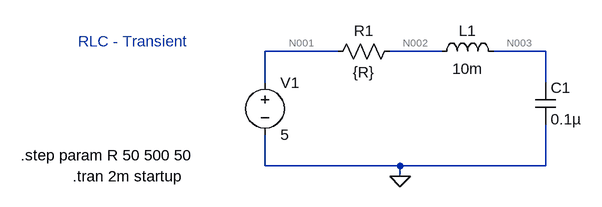
[diagram p0: schematic RLC_trans.asc]
RLC_trans.asc, the LTspice schematic file:
Version 4
SHEET 1 880 680
WIRE 80 128 -32 128
WIRE 240 128 160 128
WIRE 400 128 320 128
WIRE -32 176 -32 128
WIRE 400 176 400 128
WIRE -32 304 -32 256
WIRE 176 304 -32 304
WIRE 400 304 400 240
WIRE 400 304 176 304
WIRE 176 320 176 304
FLAG 176 320 0
SYMBOL res 176 112 R90
WINDOW 0 0 56 VBottom 2
WINDOW 3 32 56 VTop 2
SYMATTR InstName R1
SYMATTR Value {R}
SYMBOL ind 224 144 R270
WINDOW 0 32 56 VTop 2
WINDOW 3 5 56 VBottom 2
SYMATTR InstName L1
SYMATTR Value 10m
SYMBOL cap 384 176 R0
SYMATTR InstName C1
SYMATTR Value 0.1µ
SYMBOL voltage -32 160 R0
SYMATTR InstName V1
SYMATTR Value 5
TEXT -328 320 Left 2 !.tran 2m startup
TEXT -408 288 Left 2 !.step param R 50 500 50
TEXT -320 112 Left 2 ;RLC - Transient

The netlist it stands for:
* RLC_trans.asc
R1 N002 N001 {R}
L1 N002 N003 10m
C1 N003 0 0.1µ
V1 N001 0 5
.tran 2m startup
.step param R 50 500 50
* RLC - Transient
.backanno
.end

* Results of the author's LTspice run, read from the files saved beside the schematic
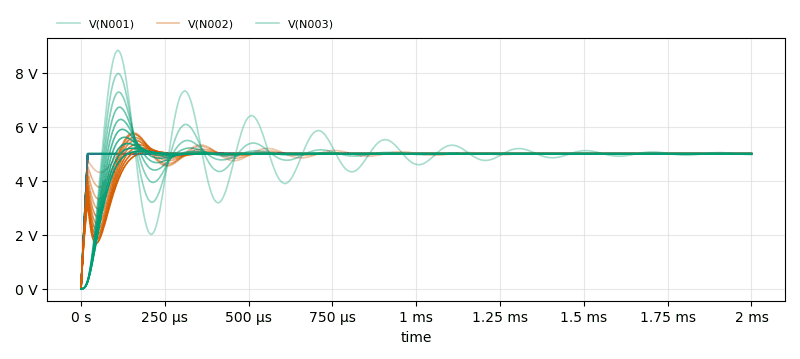
[diagram p1: Transient Analysis of RLC_trans.asc, plotted from the saved traces]
* Transient Analysis, 10 runs:
*   V(N001) [r=50]: min 0 V, max 5 V, average 4.975 V, rms 4.983 V, last 5 V
*   V(N001) [r=100]: min 0 V, max 5 V, average 4.975 V, rms 4.983 V, last 5 V
*   V(N001) [r=150]: min 0 V, max 5 V, average 4.975 V, rms 4.983 V, last 5 V
*   V(N001) [r=200]: min 0 V, max 5 V, average 4.975 V, rms 4.983 V, last 5 V
*   V(N001) [r=250]: min 0 V, max 5 V, average 4.975 V, rms 4.983 V, last 5 V
*   V(N001) [r=300]: min 0 V, max 5 V, average 4.975 V, rms 4.983 V, last 5 V
*   V(N001) [r=350]: min 0 V, max 5 V, average 4.975 V, rms 4.983 V, last 5 V
*   V(N001) [r=400]: min 0 V, max 5 V, average 4.975 V, rms 4.983 V, last 5 V
*   V(N002) [r=50]: min 0 V, max 5.537 V, average 4.963 V, rms 4.974 V, last 5.001 V
*   V(N002) [r=100]: min 0 V, max 5.749 V, average 4.95 V, rms 4.965 V, last 5 V
*   V(N002) [r=150]: min 0 V, max 5.781 V, average 4.938 V, rms 4.955 V, last 5 V
*   V(N002) [r=200]: min 0 V, max 5.719 V, average 4.925 V, rms 4.946 V, last 5 V
*   V(N002) [r=250]: min 0 V, max 5.609 V, average 4.913 V, rms 4.937 V, last 5 V
*   V(N002) [r=300]: min 0 V, max 5.48 V, average 4.9 V, rms 4.927 V, last 5 V
*   V(N002) [r=350]: min 0 V, max 5.351 V, average 4.888 V, rms 4.918 V, last 5 V
*   V(N002) [r=400]: min 0 V, max 5.232 V, average 4.875 V, rms 4.908 V, last 5 V
*   V(N003) [r=50]: min 0 V, max 8.828 V, average 4.963 V, rms 5.098 V, last 4.966 V
*   V(N003) [r=100]: min 0 V, max 7.971 V, average 4.95 V, rms 5.029 V, last 5 V
*   V(N003) [r=150]: min 0 V, max 7.282 V, average 4.937 V, rms 5 V, last 5 V
*   V(N003) [r=200]: min 0 V, max 6.724 V, average 4.925 V, rms 4.98 V, last 5 V
*   V(N003) [r=250]: min 0 V, max 6.272 V, average 4.912 V, rms 4.965 V, last 5 V
*   V(N003) [r=300]: min 0 V, max 5.904 V, average 4.9 V, rms 4.951 V, last 5 V
*   V(N003) [r=350]: min 0 V, max 5.61 V, average 4.887 V, rms 4.939 V, last 5 V
*   V(N003) [r=400]: min 0 V, max 5.378 V, average 4.875 V, rms 4.927 V, last 5 V